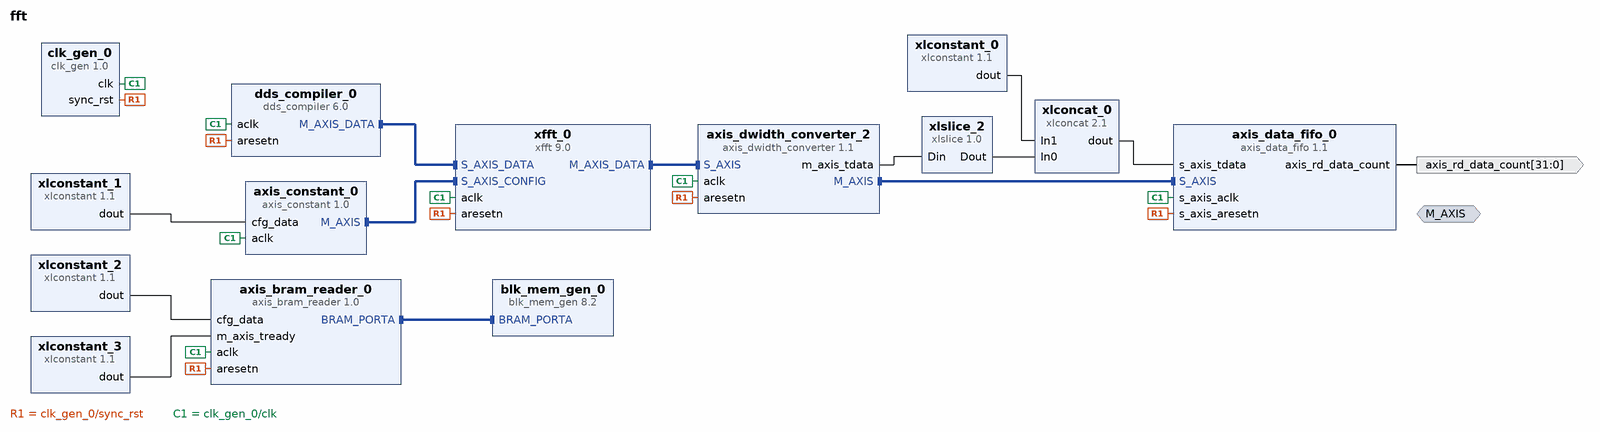
[diagram p0: block diagram of the top level]
# Vivado block design fft, Vivado 2015.2
create_bd_design fft

create_bd_intf_port -mode Master -vlnv xilinx.com:interface:axis_rtl:1.0 M_AXIS
set_property -dict {CONFIG.FREQ_HZ 125000000 CONFIG.CLK_DOMAIN ps_processing_system7_0_0_FCLK_CLK0} [get_bd_intf_ports M_AXIS]
create_bd_port -dir O -from 31 -to 0 axis_rd_data_count

create_bd_cell -type ip -vlnv xilinx.com:ip:clk_gen:1.0 clk_gen_0
set_property -dict {CONFIG.FREQ_HZ 100000000} [get_bd_cells clk_gen_0]
create_bd_cell -type ip -vlnv pavel-demin:user:axis_constant:1.0 axis_constant_0
set_property -dict {CONFIG.AXIS_TDATA_WIDTH 16} [get_bd_cells axis_constant_0]
create_bd_cell -type ip -vlnv xilinx.com:ip:axis_data_fifo:1.1 axis_data_fifo_0
set_property -dict {CONFIG.TDATA_NUM_BYTES 4 CONFIG.FIFO_DEPTH 512 CONFIG.FIFO_MODE 2} [get_bd_cells axis_data_fifo_0]
create_bd_cell -type ip -vlnv xilinx.com:ip:axis_dwidth_converter:1.1 axis_dwidth_converter_2
set_property -dict [list \
  CONFIG.S_TDATA_NUM_BYTES 8 \
  CONFIG.M_TDATA_NUM_BYTES 4 \
  CONFIG.HAS_TLAST 1 \
] [get_bd_cells axis_dwidth_converter_2]
create_bd_cell -type ip -vlnv xilinx.com:ip:dds_compiler:6.0 dds_compiler_0
set_property -dict [list \
  CONFIG.DDS_Clock_Rate 100 \
  CONFIG.Parameter_Entry System_Parameters \
  CONFIG.Spurious_Free_Dynamic_Range 150 \
  CONFIG.Frequency_Resolution 0.4 \
  CONFIG.Noise_Shaping Auto \
  CONFIG.Phase_Width 28 \
  CONFIG.Output_Width 26 \
  CONFIG.Has_Phase_Out false \
  CONFIG.Has_TREADY true \
  CONFIG.M_DATA_Has_TUSER Not_Required \
  CONFIG.Latency 12 \
  CONFIG.Has_ARESETn true \
  CONFIG.Output_Frequency1 12.5 \
  CONFIG.PINC1 10000000000000000000000000 \
] [get_bd_cells dds_compiler_0]
create_bd_cell -type ip -vlnv xilinx.com:ip:xfft:9.0 xfft_0
set_property -dict [list \
  CONFIG.transform_length 512 \
  CONFIG.target_clock_frequency 100 \
  CONFIG.implementation_options automatically_select \
  CONFIG.target_data_throughput 100 \
  CONFIG.data_format fixed_point \
  CONFIG.input_width 26 \
  CONFIG.phase_factor_width 26 \
  CONFIG.scaling_options unscaled \
  CONFIG.rounding_modes convergent_rounding \
  CONFIG.aresetn true \
  CONFIG.throttle_scheme nonrealtime \
  CONFIG.output_ordering natural_order \
  CONFIG.number_of_stages_using_block_ram_for_data_and_phase_factors 2 \
] [get_bd_cells xfft_0]
create_bd_cell -type ip -vlnv xilinx.com:ip:xlconcat:2.1 xlconcat_0
set_property -dict {CONFIG.IN0_WIDTH 24 CONFIG.IN1_WIDTH 8} [get_bd_cells xlconcat_0]
create_bd_cell -type ip -vlnv xilinx.com:ip:xlconstant:1.1 xlconstant_0
set_property -dict {CONFIG.CONST_WIDTH 8} [get_bd_cells xlconstant_0]
create_bd_cell -type ip -vlnv xilinx.com:ip:xlconstant:1.1 xlconstant_1
set_property -dict {CONFIG.CONST_WIDTH 16} [get_bd_cells xlconstant_1]
create_bd_cell -type ip -vlnv xilinx.com:ip:xlslice:1.0 xlslice_2
set_property -dict {CONFIG.DOUT_WIDTH 24 CONFIG.DIN_FROM 23} [get_bd_cells xlslice_2]
create_bd_cell -type ip -vlnv pavel-demin:user:axis_bram_reader:1.0 axis_bram_reader_0
set_property -dict {CONFIG.AXIS_TDATA_WIDTH 24 CONFIG.BRAM_DATA_WIDTH 24 CONFIG.CONTINUOUS TRUE} [get_bd_cells axis_bram_reader_0]
create_bd_cell -type ip -vlnv xilinx.com:ip:blk_mem_gen:8.2 blk_mem_gen_0
set_property -dict [list \
  CONFIG.Enable_32bit_Address false \
  CONFIG.Use_Byte_Write_Enable false \
  CONFIG.Write_Width_A 24 \
  CONFIG.Write_Depth_A 1024 \
  CONFIG.Read_Width_A 24 \
  CONFIG.Enable_A Always_Enabled \
  CONFIG.Register_PortA_Output_of_Memory_Primitives true \
  CONFIG.Load_Init_File true \
  CONFIG.Coe_File ../../../../../../../scripts/window.coe \
  CONFIG.Use_RSTA_Pin false \
  CONFIG.use_bram_block Stand_Alone \
] [get_bd_cells blk_mem_gen_0]
create_bd_cell -type ip -vlnv xilinx.com:ip:xlconstant:1.1 xlconstant_2
set_property -dict {CONFIG.CONST_WIDTH 10 CONFIG.CONST_VAL 1023} [get_bd_cells xlconstant_2]
create_bd_cell -type ip -vlnv xilinx.com:ip:xlconstant:1.1 xlconstant_3

# ---- connections ----

connect_bd_intf_net [get_bd_intf_pins axis_dwidth_converter_2/M_AXIS] [get_bd_intf_pins axis_data_fifo_0/S_AXIS]
connect_bd_intf_net [get_bd_intf_pins xfft_0/M_AXIS_DATA] [get_bd_intf_pins axis_dwidth_converter_2/S_AXIS]
connect_bd_intf_net [get_bd_intf_pins dds_compiler_0/M_AXIS_DATA] [get_bd_intf_pins xfft_0/S_AXIS_DATA]
connect_bd_intf_net [get_bd_intf_pins axis_constant_0/M_AXIS] [get_bd_intf_pins xfft_0/S_AXIS_CONFIG]
connect_bd_intf_net [get_bd_intf_pins blk_mem_gen_0/BRAM_PORTA] [get_bd_intf_pins axis_bram_reader_0/BRAM_PORTA]
connect_bd_net [get_bd_pins clk_gen_0/sync_rst] \
  [get_bd_pins axis_data_fifo_0/s_axis_aresetn] [get_bd_pins axis_dwidth_converter_2/aresetn] \
  [get_bd_pins dds_compiler_0/aresetn] [get_bd_pins xfft_0/aresetn] [get_bd_pins axis_bram_reader_0/aresetn]
connect_bd_net [get_bd_pins clk_gen_0/clk] \
  [get_bd_pins axis_constant_0/aclk] [get_bd_pins axis_data_fifo_0/s_axis_aclk] [get_bd_pins axis_dwidth_converter_2/aclk] \
  [get_bd_pins dds_compiler_0/aclk] [get_bd_pins xfft_0/aclk] [get_bd_pins axis_bram_reader_0/aclk]
connect_bd_net [get_bd_pins xlconstant_0/dout] [get_bd_pins xlconcat_0/In1]
connect_bd_net [get_bd_pins xlconcat_0/dout] [get_bd_pins axis_data_fifo_0/s_axis_tdata]
connect_bd_net [get_bd_pins xlslice_2/Dout] [get_bd_pins xlconcat_0/In0]
connect_bd_net [get_bd_pins axis_dwidth_converter_2/m_axis_tdata] [get_bd_pins xlslice_2/Din]
connect_bd_net [get_bd_pins axis_data_fifo_0/axis_rd_data_count] [get_bd_ports axis_rd_data_count]
connect_bd_net [get_bd_pins xlconstant_1/dout] [get_bd_pins axis_constant_0/cfg_data]
connect_bd_net [get_bd_pins xlconstant_2/dout] [get_bd_pins axis_bram_reader_0/cfg_data]
connect_bd_net [get_bd_pins xlconstant_3/dout] [get_bd_pins axis_bram_reader_0/m_axis_tready]

validate_bd_design
save_bd_design
